# EAGLE design LIC_rack_HUSB-00 (EAGLE 7.2.0)
AUTHOR: M. Petrilak; VERSION: 00

## Sheet 1 of 4
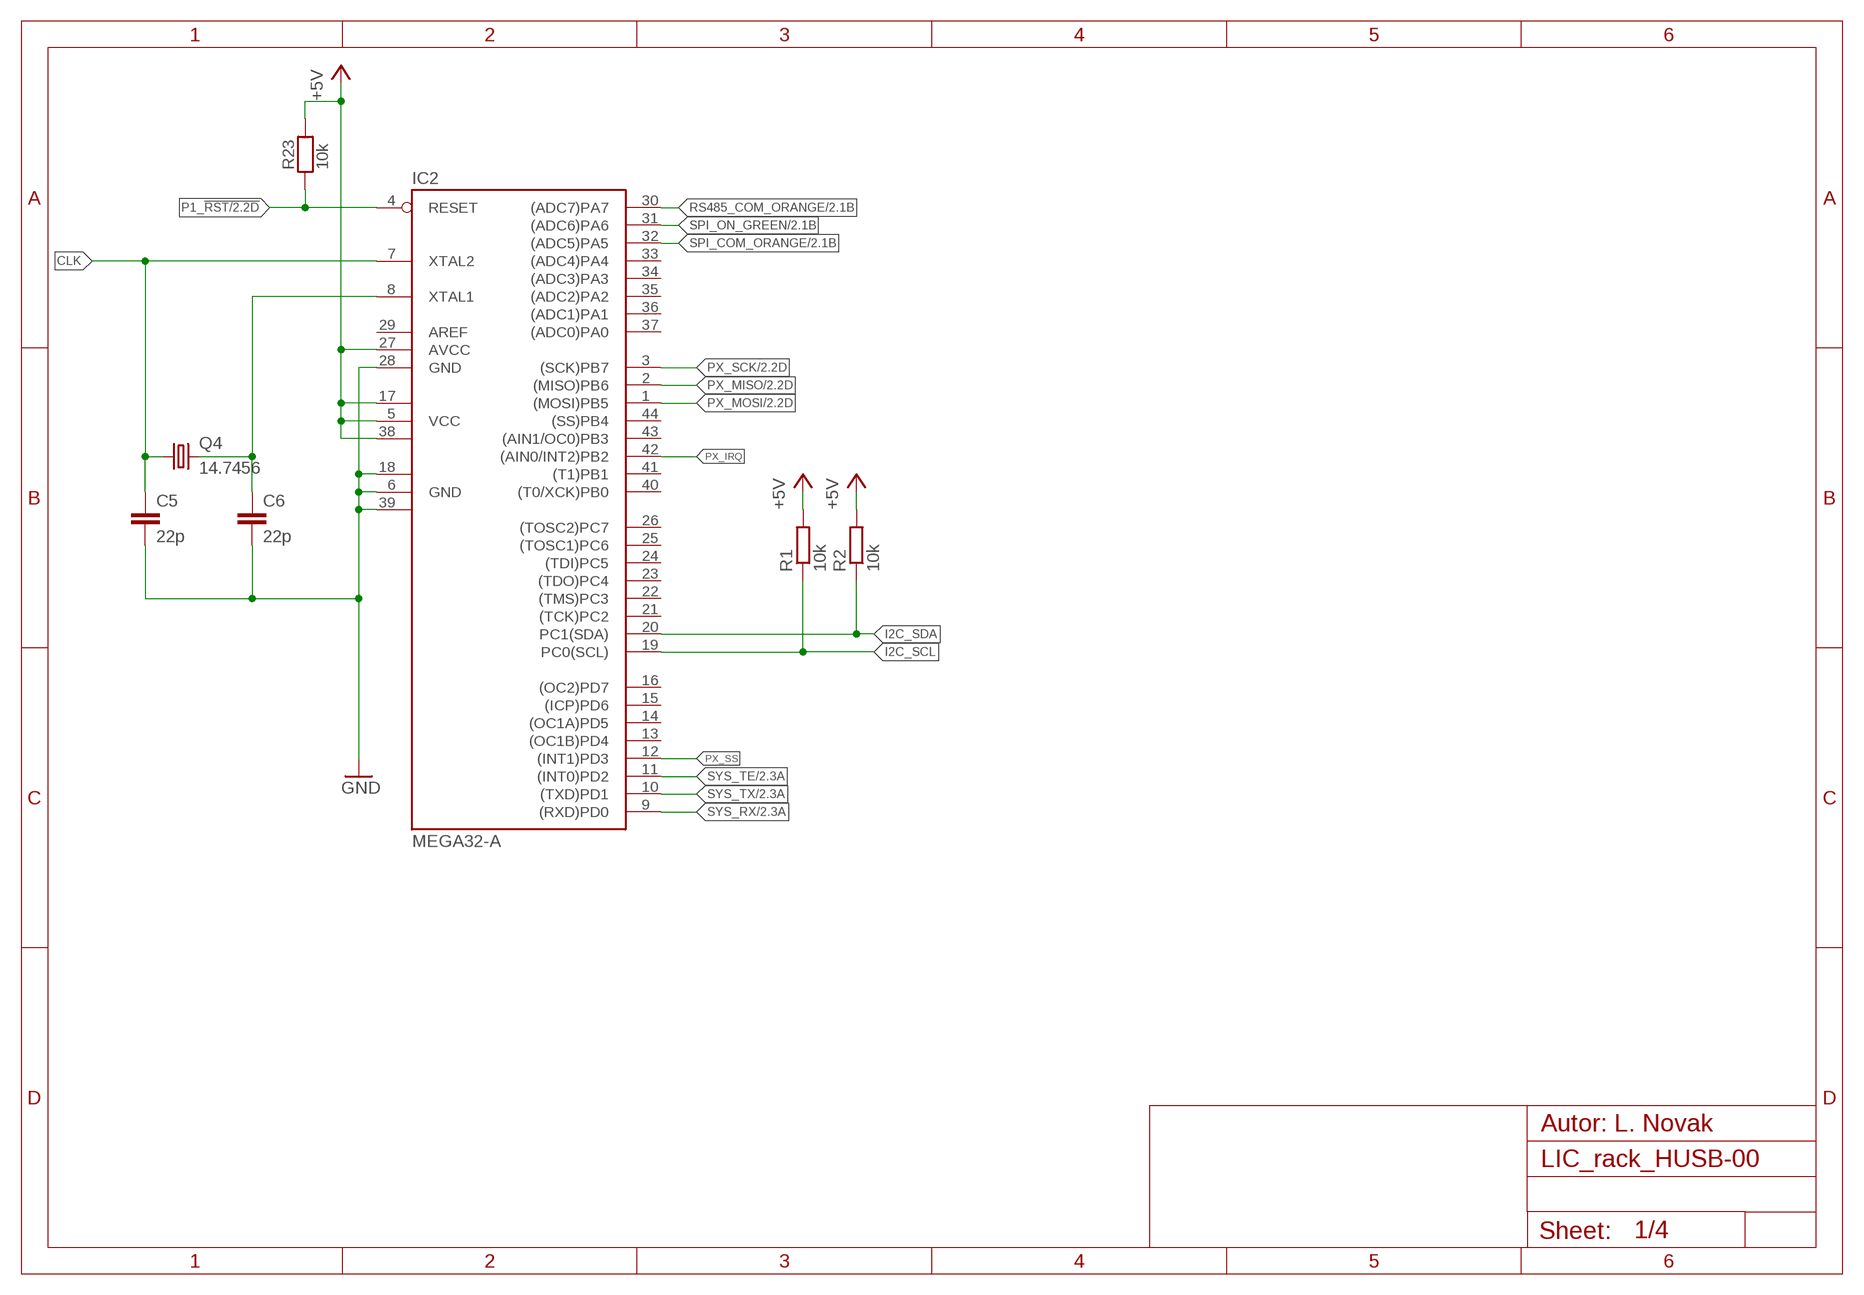
[diagram p0: schematic, sheet 1]

### Parts
C5  22p  C-EUC0805  [C0805]
C6  22p  C-EUC0805  [C0805]
IC2  MEGA32-A  [TQFP44]
Q4  14.7456  XTAL  [HC49U70]
R1  10k  R-EU_R1206  [R1206]
R2  10k  R-EU_R1206  [R1206]
R23  10k  R_1206  [1206]

### Nets
+5V: IC2.5(VCC) IC2.17(VCC1) IC2.27(AVCC) IC2.38(VCC2) R1.2 R2.2 R23.2 ; also sheet 2
CLK: C5.1 IC2.7(XTAL2) Q4.1
GND: C5.2 C6.2 IC2.6(GND) IC2.18(GND1) IC2.28(GND) IC2.39(GND2) ; also sheet 2
I2C_SCL: IC2.19(PC0(SCL)) R1.1
I2C_SDA: IC2.20(PC1(SDA)) R2.1
N$19: C6.1 IC2.8(XTAL1) Q4.2
P1_!RST: IC2.4(RESET) R23.1 ; also sheet 2
PX_IRQ: IC2.42((AIN0/INT2)PB2)
PX_MISO: IC2.2((MISO)PB6) ; also sheet 2
PX_MOSI: IC2.1((MOSI)PB5) ; also sheet 2
PX_SCK: IC2.3((SCK)PB7) ; also sheet 2
PX_SS: IC2.12((INT1)PD3)
RS485_COM_ORANGE: IC2.30((ADC7)PA7) ; also sheet 2
SPI_COM_ORANGE: IC2.32((ADC5)PA5) ; also sheet 2
SPI_ON_GREEN: IC2.31((ADC6)PA6) ; also sheet 2
SYS_RX: IC2.9((RXD)PD0) ; also sheet 2
SYS_TE: IC2.11((INT0)PD2) ; also sheet 2
SYS_TX: IC2.10((TXD)PD1) ; also sheet 2
Unconnected: IC2.13((OC1B)PD4) IC2.14((OC1A)PD5) IC2.15((ICP)PD6) IC2.16((OC2)PD7) IC2.21((TCK)PC2) IC2.22((TMS)PC3) IC2.23((TDO)PC4) IC2.24((TDI)PC5) IC2.25((TOSC1)PC6) IC2.26((TOSC2)PC7) IC2.29(AREF) IC2.33((ADC4)PA4) IC2.34((ADC3)PA3) IC2.35((ADC2)PA2) IC2.36((ADC1)PA1) IC2.37((ADC0)PA0) IC2.40((T0/XCK)PB0) IC2.41((T1)PB1) IC2.43((AIN1/OC0)PB3) IC2.44((SS)PB4)

## Sheet 2 of 4
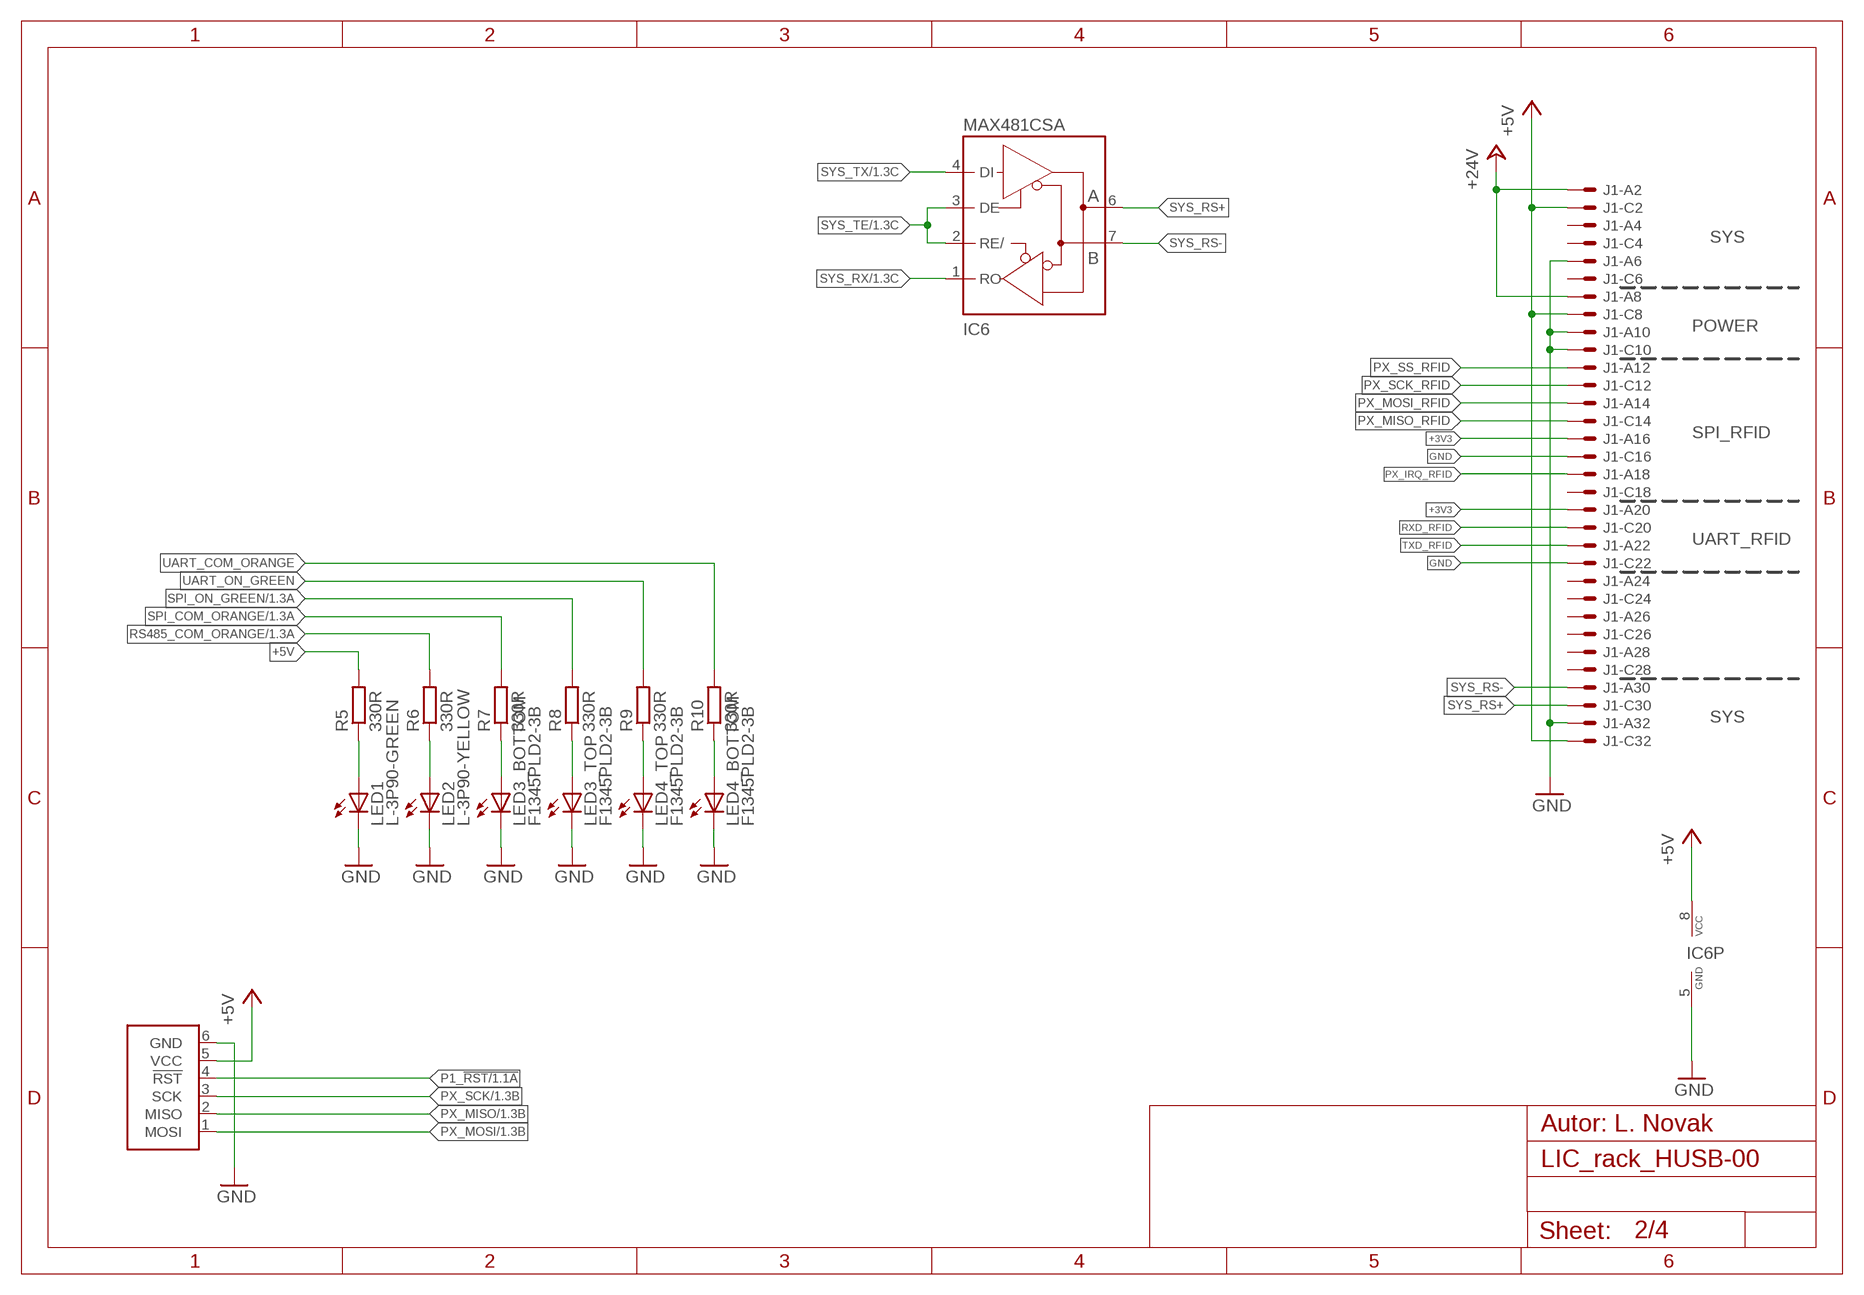
[diagram p1: schematic, sheet 2]

### Parts
IC6  MAX481CSA  [SO08]
J1  VG32SP  [VG32P]
LED1  L-3P90-GREEN  [L-3P90]
LED2  L-3P90-YELLOW  [L-3P90]
LED3  F1345PLD2-3B  [F1345PLD2-3B]
LED4  F1345PLD2-3B  [F1345PLD2-3B]
R5  330R  R-EU_R1206  [R1206]
R6  330R  R-EU_R1206  [R1206]
R7  330R  R-EU_R1206  [R1206]
R8  330R  R-EU_R1206  [R1206]
R9  330R  R-EU_R1206  [R1206]
R10  330R  R-EU_R1206  [R1206]
U1  ATPROG-V  [6410-06]

### Nets
+3V3: J1.A16 J1.A20
+5V: IC6.8(VCC) J1.C2 J1.C8 J1.C32 R5.2 U1.5(VCC) ; also sheet 1
+24V: J1.A2 J1.A8
GND: IC6.5(GND) J1.A6 J1.A10 J1.A32 J1.C10 J1.C16 J1.C22 LED1.K(C) LED2.K(C) LED3.1K(C) LED3.2K(C) LED4.1K(C) LED4.2K(C) U1.6(GND) ; also sheet 1
N$1: LED2.A R6.1
N$2: LED1.A R5.1
N$9: LED4.1A(A) R10.1
N$10: LED4.2A(A) R9.1
N$11: LED3.2A(A) R8.1
N$12: LED3.1A(A) R7.1
P1_!RST: U1.4(!RST) ; also sheet 1
PX_IRQ_RFID: J1.A18
PX_MISO: U1.2(MISO) ; also sheet 1
PX_MISO_RFID: J1.C14
PX_MOSI: U1.1(MOSI) ; also sheet 1
PX_MOSI_RFID: J1.A14
PX_SCK: U1.3(SCK) ; also sheet 1
PX_SCK_RFID: J1.C12
PX_SS_RFID: J1.A12
RS485_COM_ORANGE: R6.2 ; also sheet 1
RXD_RFID: J1.C20
SPI_COM_ORANGE: R7.2 ; also sheet 1
SPI_ON_GREEN: R8.2 ; also sheet 1
SYS_RS+: IC6.6(A) J1.C30
SYS_RS-: IC6.7(B) J1.A30
SYS_RX: IC6.1(RO) ; also sheet 1
SYS_TE: IC6.2(RE/) IC6.3(DE) ; also sheet 1
SYS_TX: IC6.4(DI) ; also sheet 1
TXD_RFID: J1.A22
UART_COM_ORANGE: R10.2
UART_ON_GREEN: R9.2
Unconnected: J1.A4 J1.A24 J1.A26 J1.A28 J1.C4 J1.C6 J1.C18 J1.C24 J1.C26 J1.C28

### Notes on the sheet
- SYS
- POWER
- SPI_RFID
- UART_RFID
- SYS

## Sheet 3 of 4
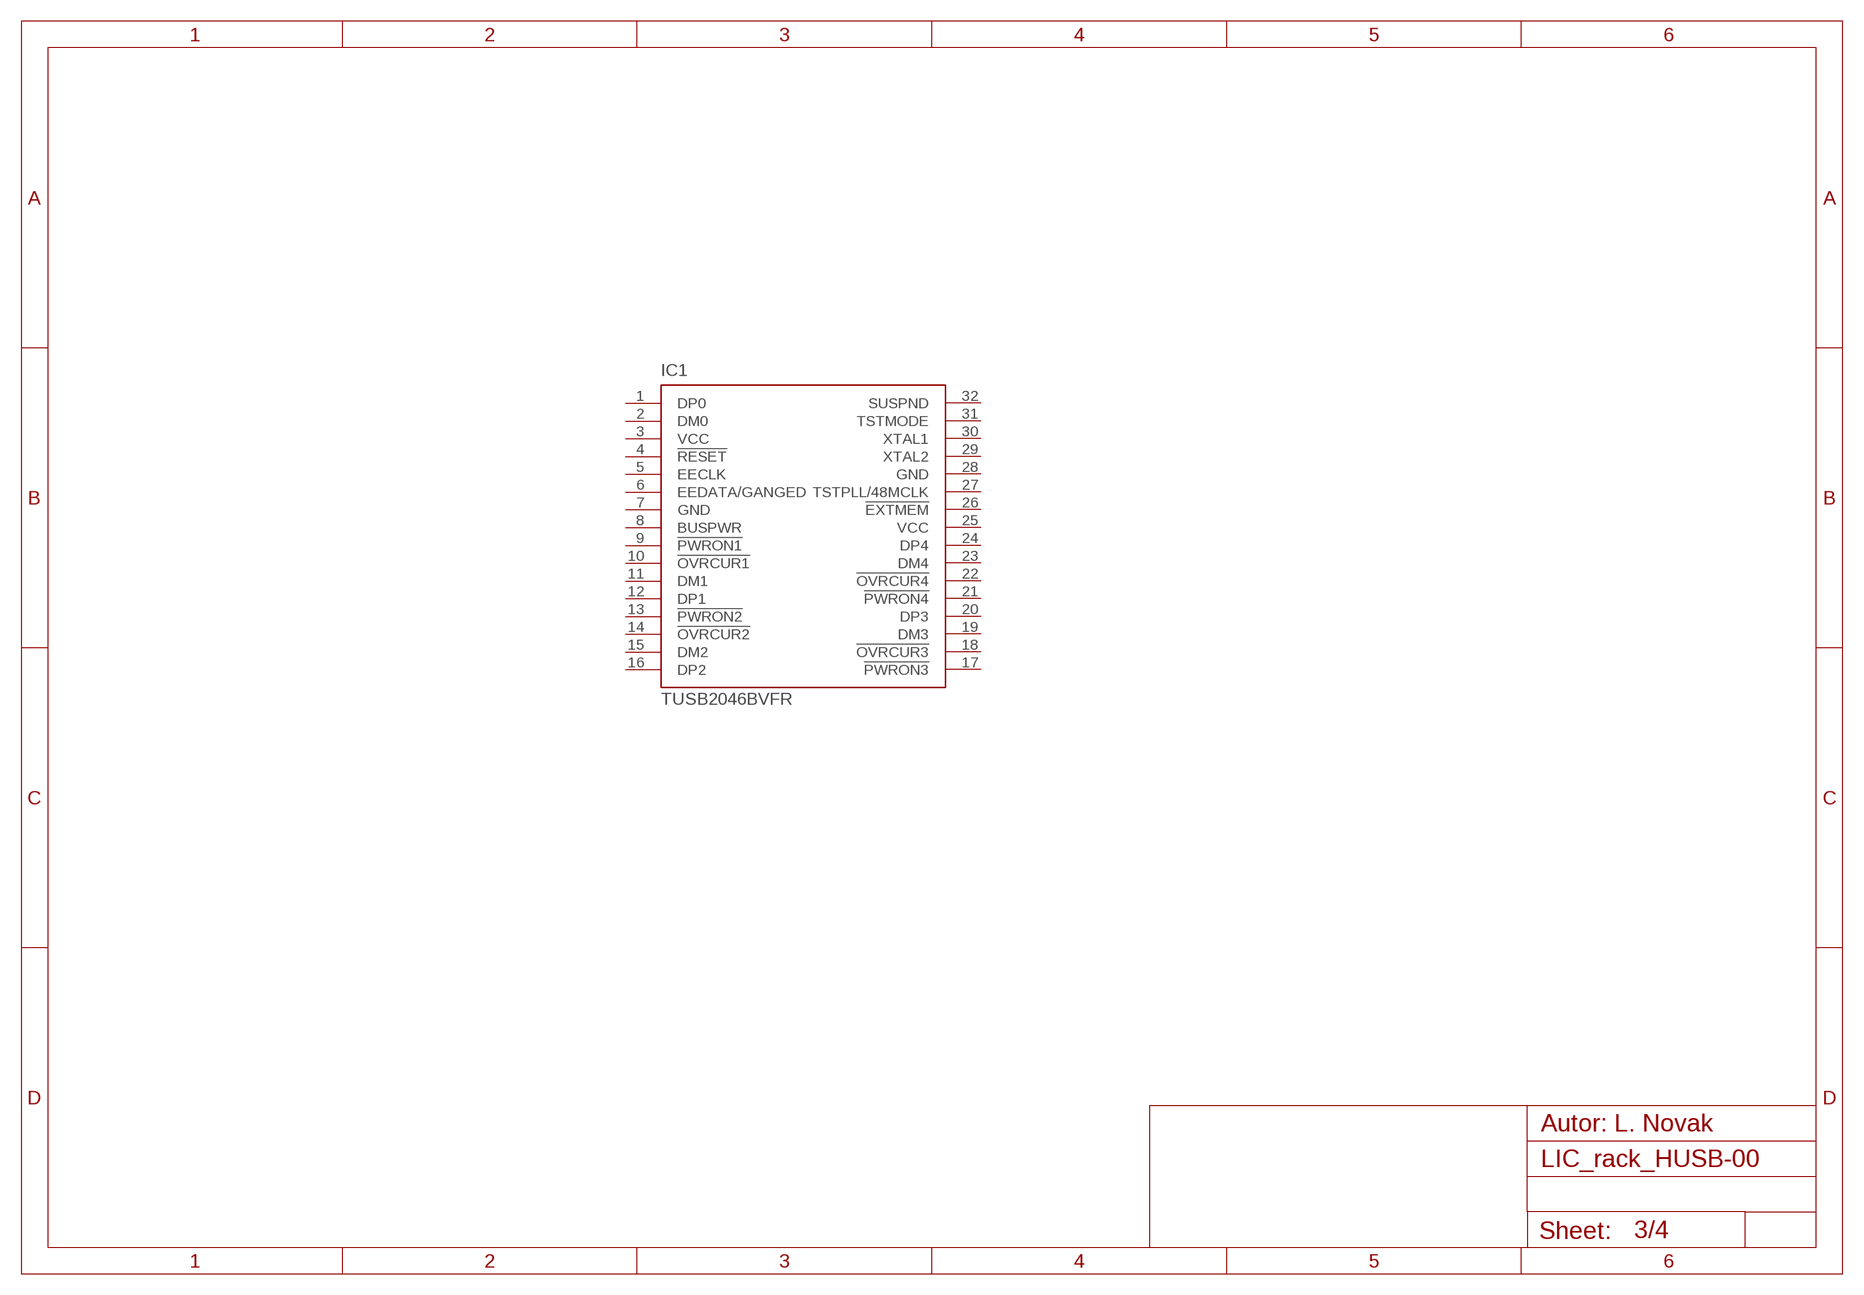
[diagram p2: schematic, sheet 3]

### Parts
IC1  TUSB2046BVFR  [VF_S-PQFP-G32]
Unconnected: IC1.1(DP0) IC1.2(DM0) IC1.4(!RESET) IC1.5(EECLK) IC1.6(EEDATA/GANGED) IC1.8(BUSPWR) IC1.9(!PWRON1) IC1.10(!OVRCUR1) IC1.11(DM1) IC1.12(DP1) IC1.13(!PWRON2) IC1.14(!OVRCUR2) IC1.15(DM2) IC1.16(DP2) IC1.17(!PWRON3) IC1.18(!OVRCUR3) IC1.19(DM3) IC1.20(DP3) IC1.21(!PWRON4) IC1.22(!OVRCUR4) IC1.23(DM4) IC1.24(DP4) IC1.26(!EXTMEM) IC1.27(TSTPLL/48MCLK) IC1.29(XTAL2) IC1.30(XTAL1) IC1.31(TSTMODE) IC1.32(SUSPND)

## Sheet 4 of 4
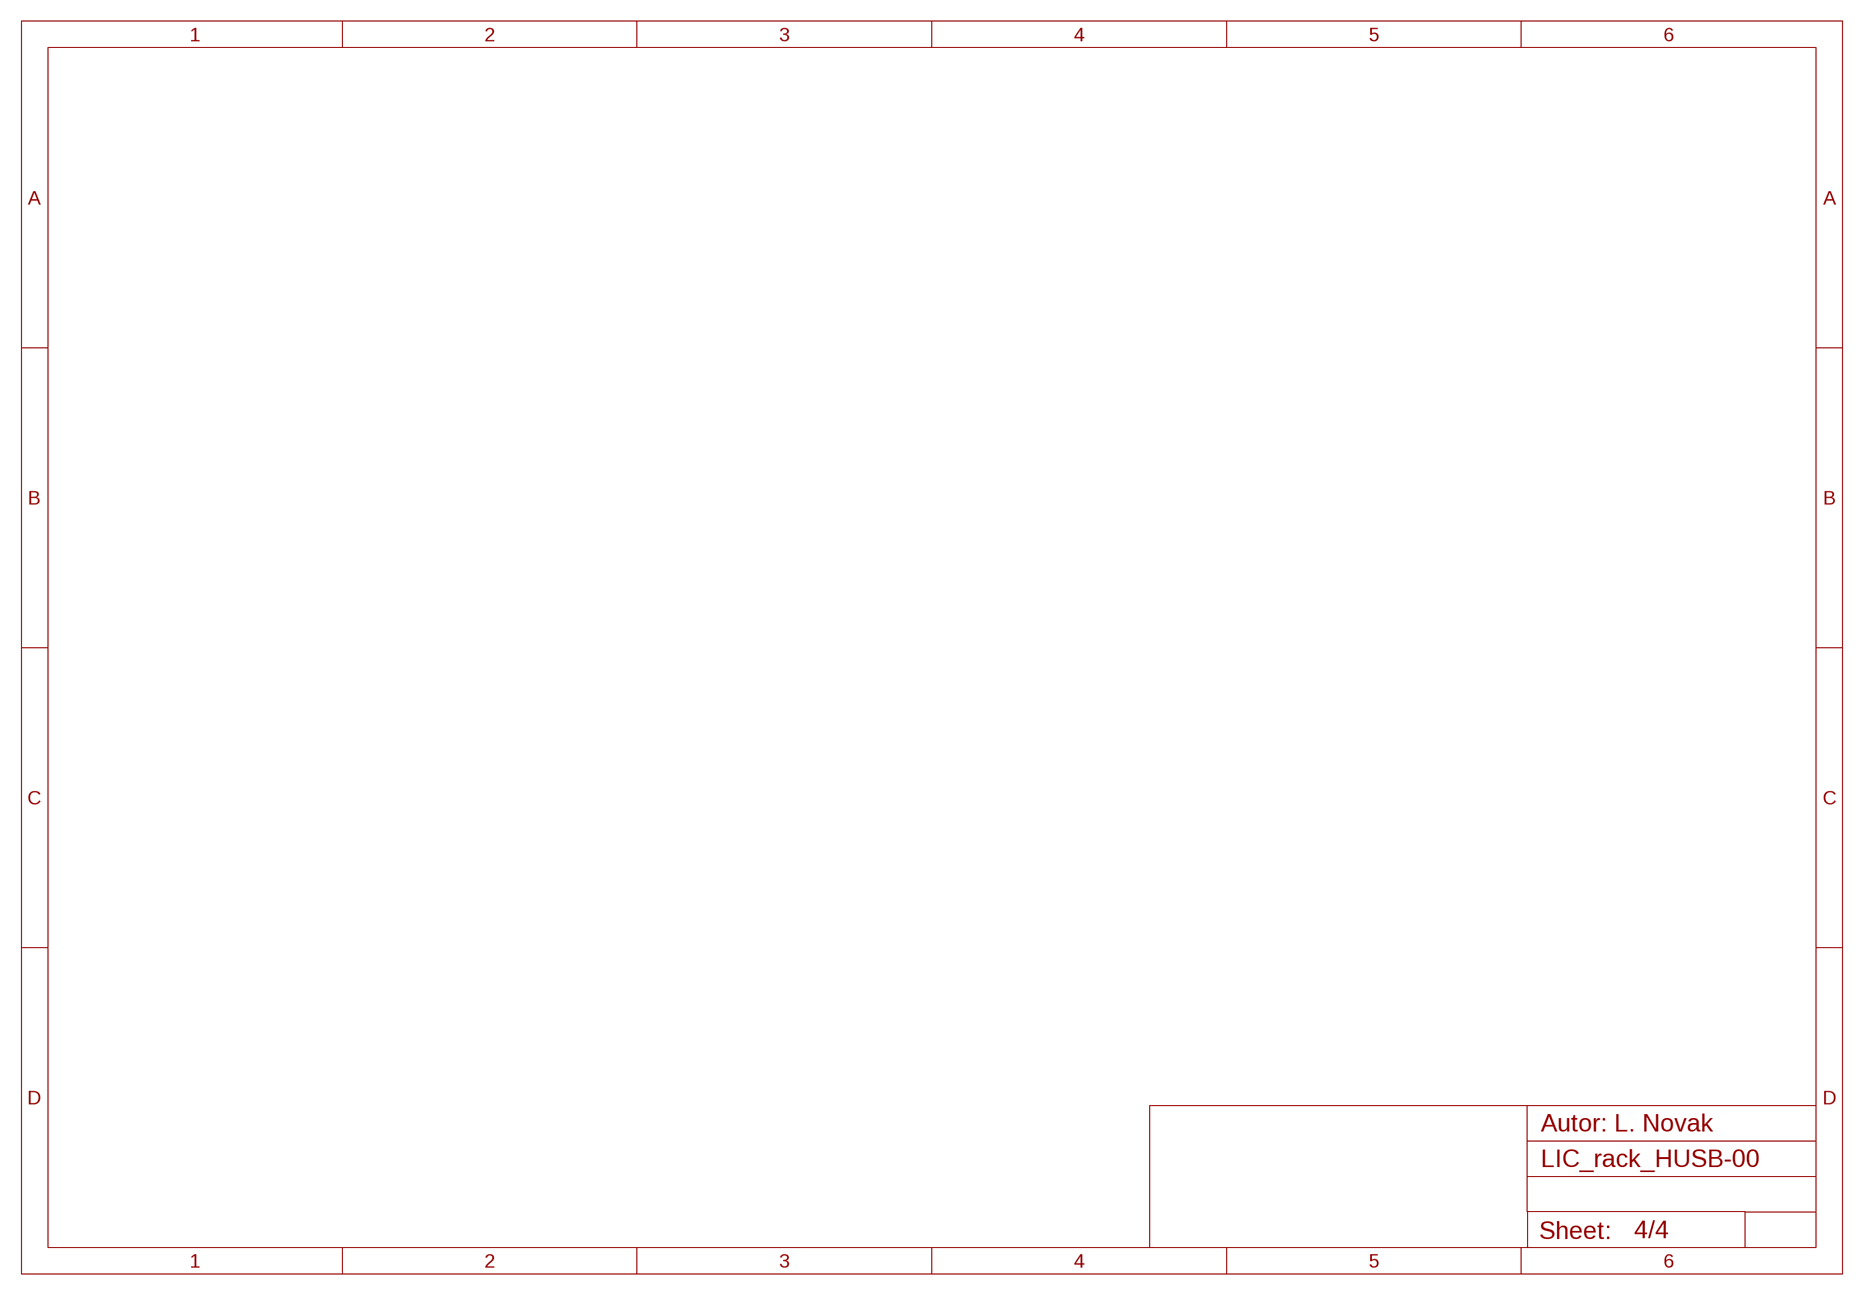
[diagram p3: schematic, sheet 4]

## Power pins joined to a net without a drawn wire
GND: IC1.7(GND) IC1.28(GND)
VCC: IC1.3(VCC) IC1.25(VCC)

## Library data of the parts
C5 C6 = rcl:C-EU: CAPACITOR, European symbol
IC1 = texas:TUSB2046B: 4-PORT HUB FOR THE UNIVERSAL SERIAL BUS WITH OPTIONAL SERIAL EEPROM INTERFACE Auto generated by make-symbol-device-package-bsdl.ulp Rev. 30 Source: http://focus.ti.com/lit/ds/symlink/tusb2046b.pdf; MF: TEXAS INSTRUMENTS; MPN: TUSB2046BVFR; OC_FARNELL: 1470507; OC_NEWARK: 77C1806
IC2 = atmel:MEGA32: MICROCONTROLLER 32 Kbytes FLASH 2 Kbytes SRAM 1 Kbytes EEPROM USART 8-channel 10 bit ADC Source: www.atmel.com .. doc2503.pdf; MPN: ATMEGA32-16AU; OC_FARNELL: 9171274; OC_NEWARK: 69K6677
IC6 = maxim:MAX481CSA: RS485 TRANSEIVER
J1 = 19inch:VG32S: PCB EUROCARD, 32-pin type C/AC, 5.08 mm
LED1 LED2 = led:L-3P90
LED3 LED4 = led:F1345PLD2-3B
Q4 = crystal:XTAL
R1 R2 R5-R10 = rcl:R-EU_: RESISTOR, European symbol
R23 = #PaJa_31:R: Rezistor
U1 = con-molex:ATPROG

## Board
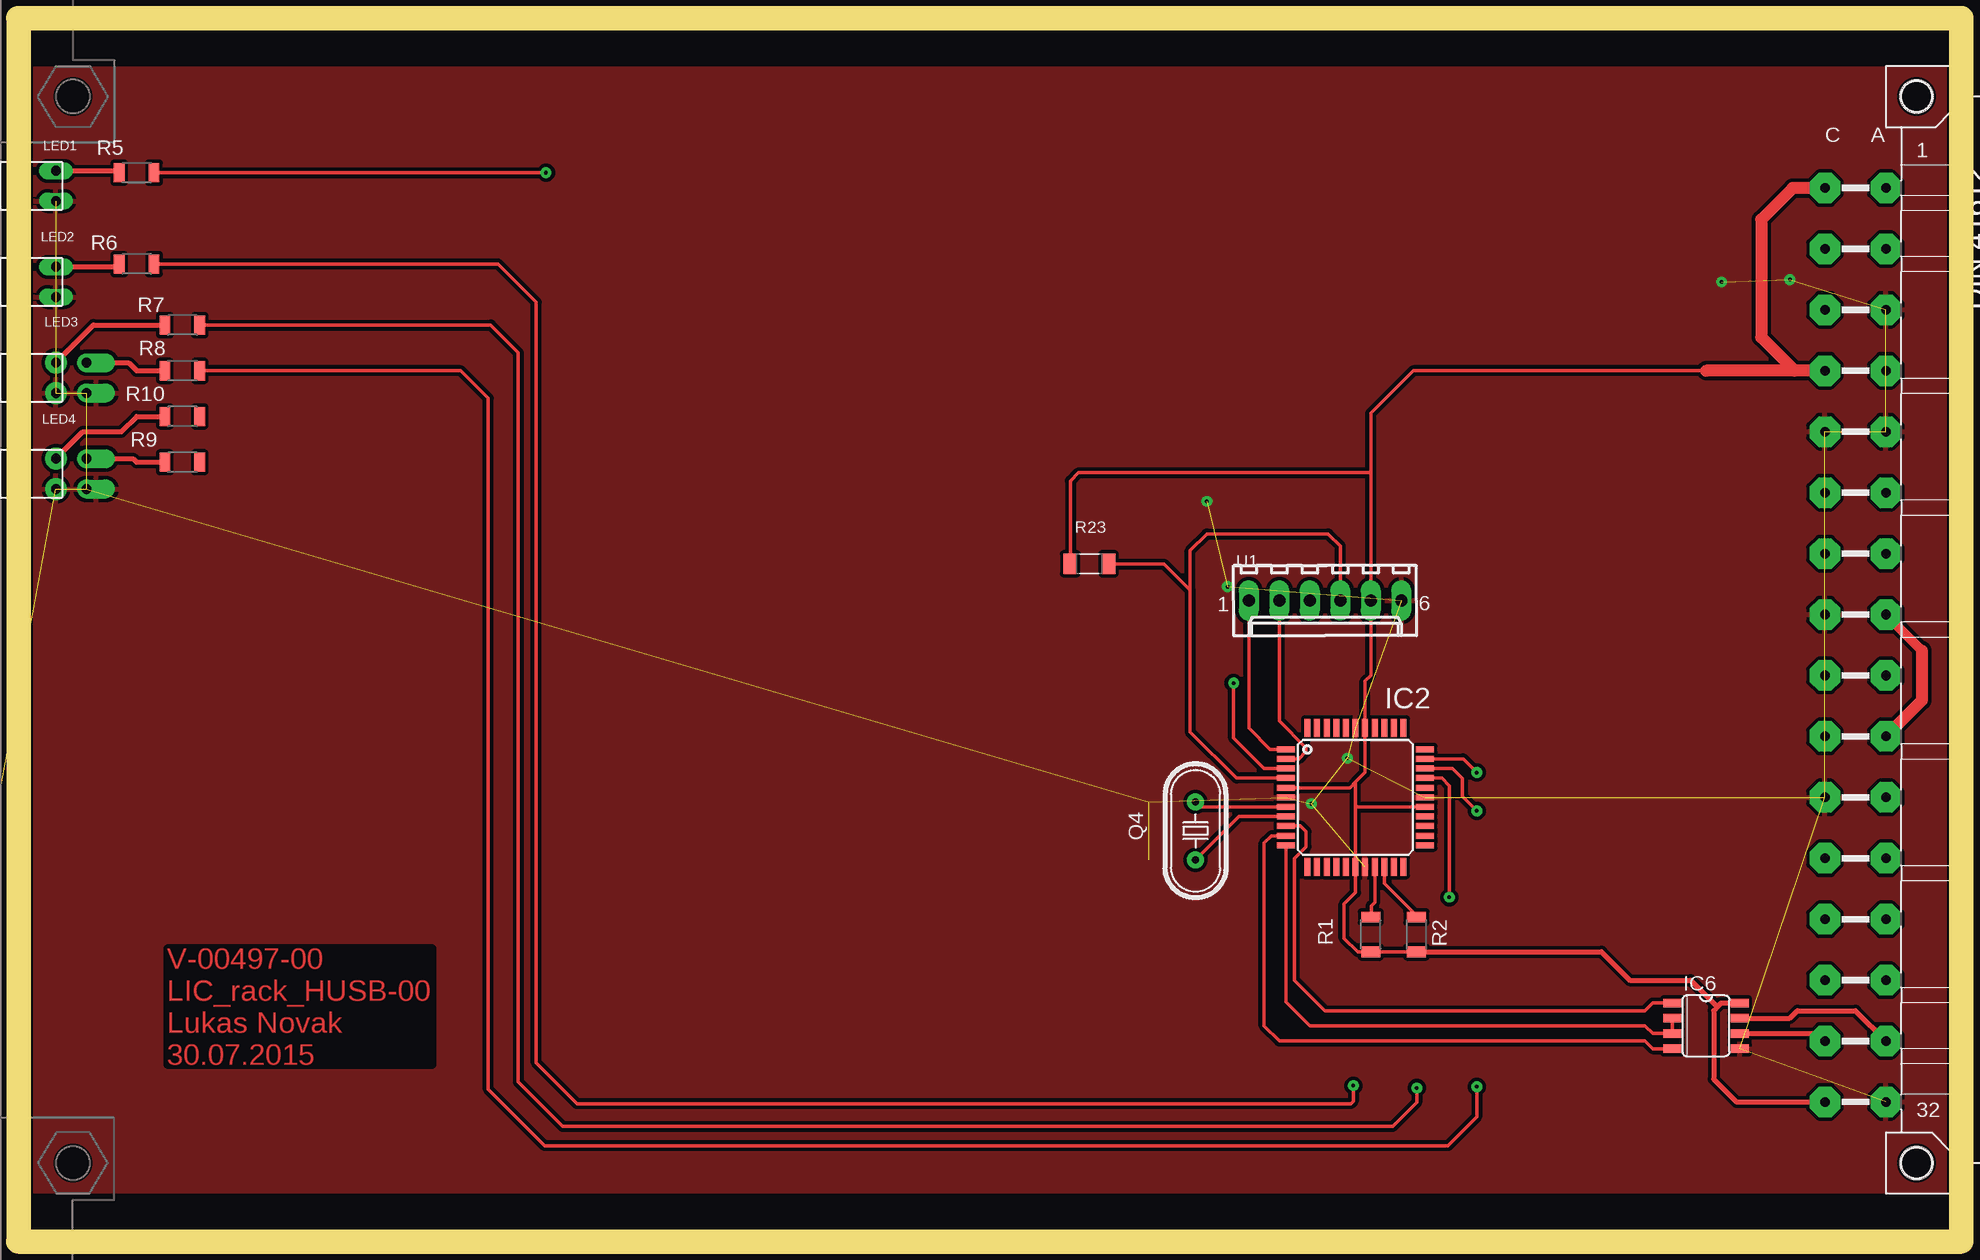
[diagram p4: board, top side]
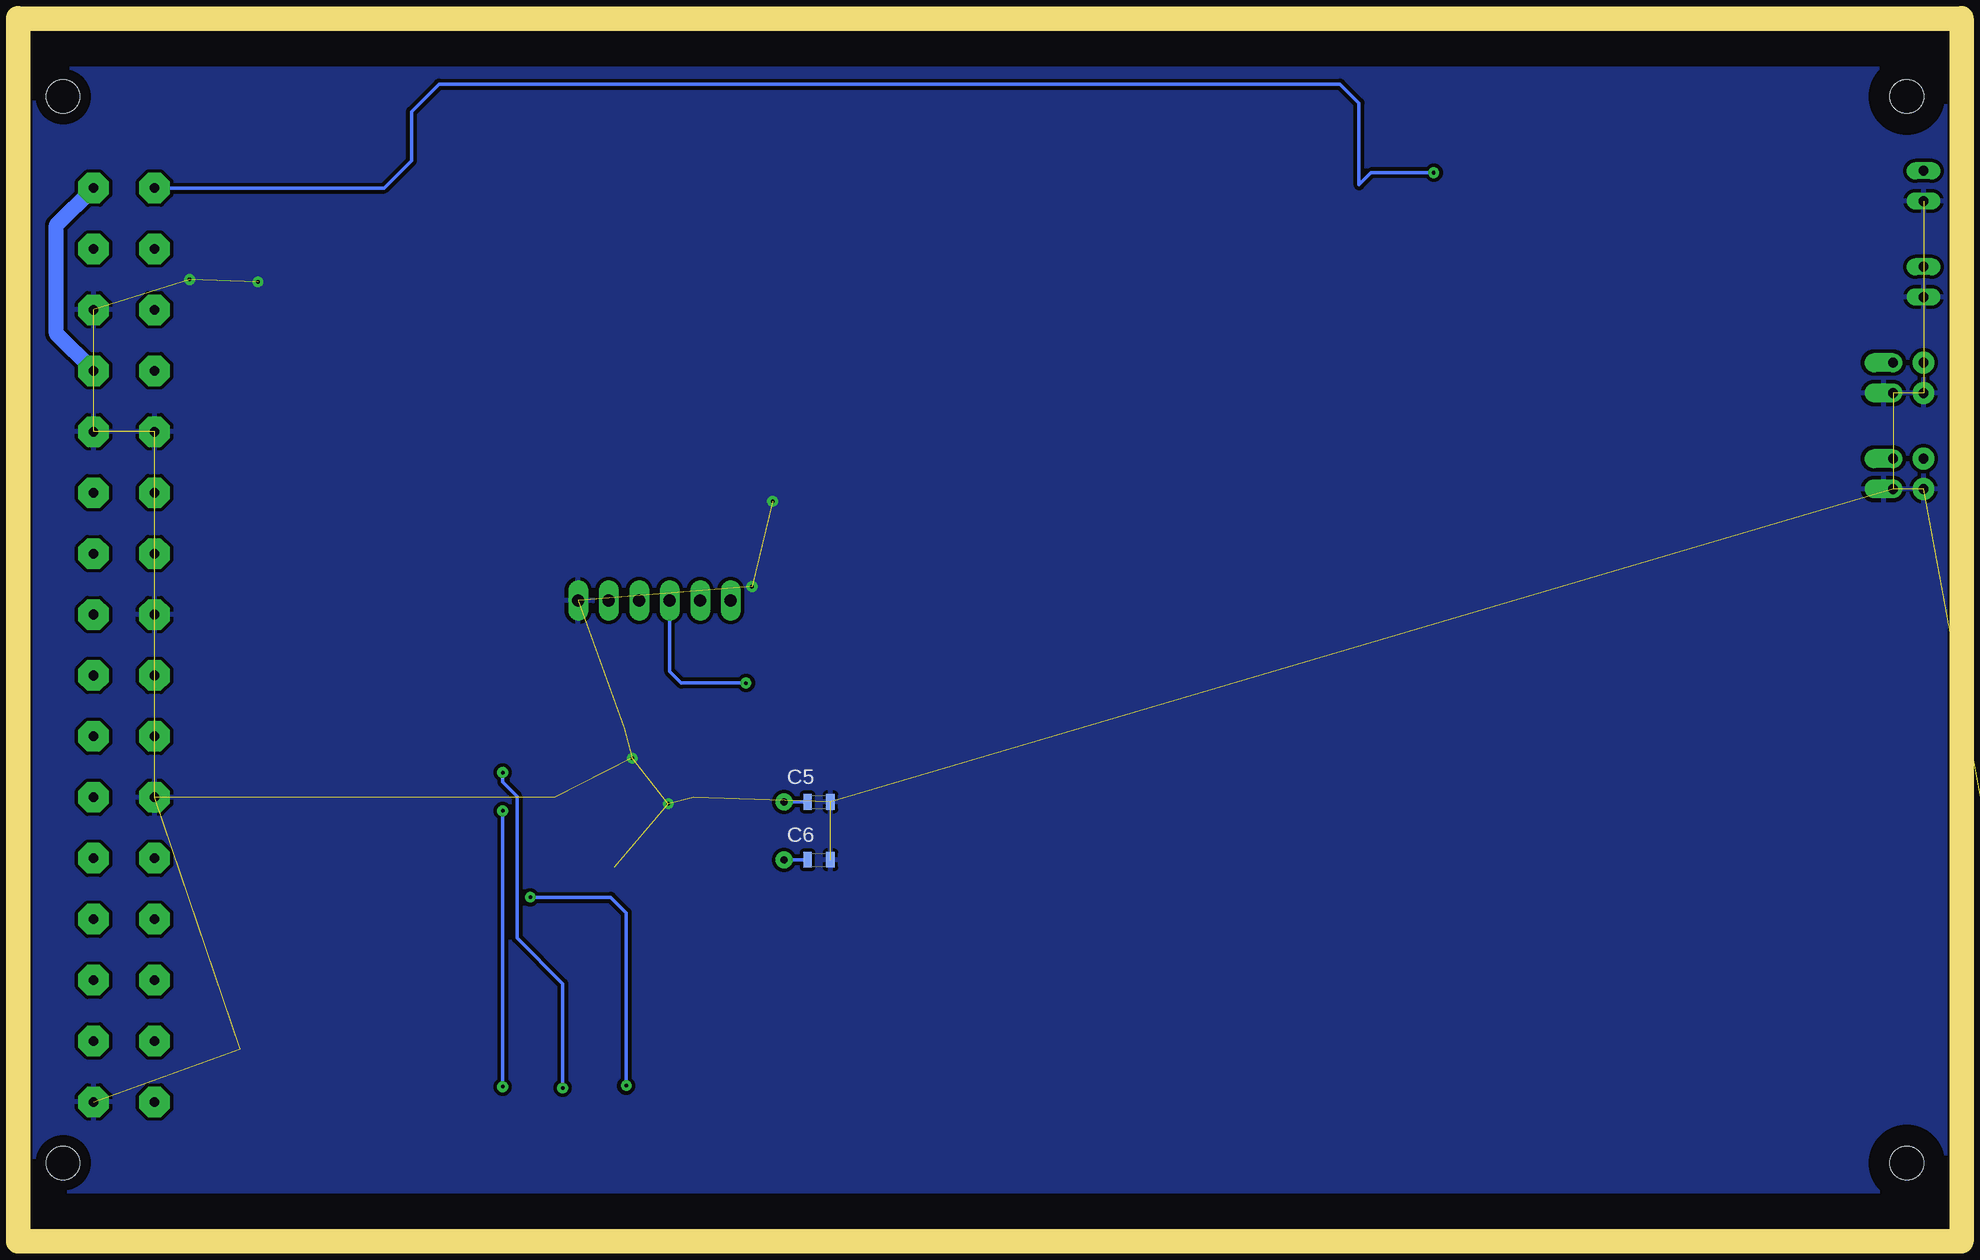
[diagram p5: board, bottom side, seen from below]

Size 160 x 100 mm. Coordinates in mm from the lower left corner, seen from the top.
Copper layers (1*16): Top 0.04mm / dielectric 1.5mm / Bottom 0.04mm
Design rules "mucha_navrh_my_fine *": minimum track width 0.2mm, minimum drill 0.3mm, track to track 0.3mm, track to pad 0.3mm, pad to pad 0.3mm, via to via 0.3mm, smd to smd 0mil, copper to edge 0.2mm, drill to drill 0.2mm, minimum pad ring 0.3mm, minimum via ring 0.3mm, stop-mask expansion 0.1mm, vias tented up to drill 0.5mm, thermal gap 0.3mm

### Footprints (pad centres in the part's own frame; a part is rotated, then mirrored left to right if it is on the bottom)
C0805 = smd 0.7 x 1.3: 1 -0.95,0; 2 0.95,0
VF_S-PQFP-G32 = smd 1.05 x 0.5: 1 -4.375,2.8; 2 -4.375,2; 3 -4.375,1.2; 4 -4.375,0.4; 5 -4.375,-0.4; 6 -4.375,-1.2; 7 -4.375,-2; 8 -4.375,-2.8; 17 4.375,-2.8; 18 4.375,-2; 19 4.375,-1.2; 20 4.375,-0.4; 21 4.375,0.4; 22 4.375,1.2; 23 4.375,2; 24 4.375,2.8 | smd 0.5 x 1.05: 9 -2.8,-4.375; 10 -2,-4.375; 11 -1.2,-4.375; 12 -0.4,-4.375; 13 0.4,-4.375; 14 1.2,-4.375; 15 2,-4.375; 16 2.8,-4.375; 25 2.8,4.375; 26 2,4.375; 27 1.2,4.375; 28 0.4,4.375; 29 -0.4,4.375; 30 -1.2,4.375; 31 -2,4.375; 32 -2.8,4.375
TQFP44 = smd 1.5 x 0.5: 1 -5.8,4; 2 -5.8,3.2; 3 -5.8,2.4; 4 -5.8,1.6; 5 -5.8,0.8; 6 -5.8,0; 7 -5.8,-0.8; 8 -5.8,-1.6; 9 -5.8,-2.4; 10 -5.8,-3.2; 11 -5.8,-4; 23 5.8,-4; 24 5.8,-3.2; 25 5.8,-2.4; 26 5.8,-1.6; 27 5.8,-0.8; 28 5.8,0; 29 5.8,0.8; 30 5.8,1.6; 31 5.8,2.4; 32 5.8,3.2; 33 5.8,4 | smd 0.5 x 1.5: 12 -4,-5.8; 13 -3.2,-5.8; 14 -2.4,-5.8; 15 -1.6,-5.8; 16 -0.8,-5.8; 17 0,-5.8; 18 0.8,-5.8; 19 1.6,-5.8; 20 2.4,-5.8; 21 3.2,-5.8; 22 4,-5.8; 34 4,5.8; 35 3.2,5.8; 36 2.4,5.8; 37 1.6,5.8; 38 0.8,5.8; 39 0,5.8; 40 -0.8,5.8; 41 -1.6,5.8; 42 -2.4,5.8; 43 -3.2,5.8; 44 -4,5.8
SO08 = smd 0.72 x 1.5: 1 -1.905,-2.8; 2 -0.635,-2.8; 3 0.635,-2.8; 4 1.905,-2.8; 5 1.905,2.8; 6 0.635,2.8; 7 -0.635,2.8; 8 -1.905,2.8
VG32P = drill 0.8 pad 2.54 octagon: A2 154.7,36.83; A4 154.7,31.75; A6 154.7,26.67; A8 154.7,21.59; A10 154.7,16.51; A12 154.7,11.43; A14 154.7,6.35; A16 154.7,1.27; A18 154.7,-3.81; A20 154.7,-8.89; A22 154.7,-13.97; A24 154.7,-19.05; A26 154.7,-24.13; A28 154.7,-29.21; A30 154.7,-34.29; A32 154.7,-39.37; C2 149.62,36.83; C4 149.62,31.75; C6 149.62,26.67; C8 149.62,21.59; C10 149.62,16.51; C12 149.62,11.43; C14 149.62,6.35; C16 149.62,1.27; C18 149.62,-3.81; C20 149.62,-8.89; C22 149.62,-13.97; C24 149.62,-19.05; C26 149.62,-24.13; C28 149.62,-29.21; C30 149.62,-34.29; C32 149.62,-39.37 | hole 2.794: 3.57,44.45; 3.57,-44.45; 157.24,44.45; 157.24,-44.45; 3.57,44.45; 3.57,-44.45; 157.24,44.45; 157.24,-44.45
L-3P90 = drill 0.813 long: A 4.7,1.27; K 4.7,-1.27
F1345PLD2-3B = drill 0.8 pad 1.8: 1A 4.7,1.27; 1K 4.7,-1.27 | drill 0.8 pad 1.6 offset: 2A 7.24,1.27; 2K 7.24,-1.27
HC49U70 = drill 0.6 pad 1.4: 1 -2.413,0; 2 2.413,0
R1206 = smd 0.9 x 1.6: 1 -1.45,0; 2 1.45,0
1206 = smd 1.143 x 1.702: 1 -1.587,0; 2 1.587,0
6410-06 = drill 1.016 long: 1 6.35,0; 2 3.81,0; 3 1.27,0; 4 -1.27,0; 5 -3.81,0; 6 -6.35,0

### Placement (x,y rotation side)
C5  94.23,35.65 0 bottom
C6  94.23,30.82 0 bottom
IC1  -10.2,-7.4 0 top  (outside the outline)
IC2  110.49,36.03 0 top
IC6  139.7,16.98 270 top
J1  0,50 0 top
LED1  -2.54,87 0 top
LED2  -2.54,79 0 top
LED3  -2.54,71 0 top
LED4  -2.54,63 0 top
Q4  97.16,33.24 270 top
R1  111.76,24.6 270 top
R2  115.57,24.6 270 top
R5  8.89,88.1 0 top
R6  8.89,80.48 0 top
R7  12.7,75.4 0 top
R8  12.7,71.59 0 top
R9  12.7,63.97 0 top
R10  12.7,67.78 0 top
R23  88.3,55.5 180 top
U1  107.95,52.43 180 top

### Tracks (layer width: path | path; a pad name or v marks a point on that pad's centre or on a via)
+3V3
  Top 0.813: 157.7,48.27 J1.A16
  Top 1.016: J1.A20 157.7,44.11 157.7,48.27
+5V  (via drill 0.3)
  Top 0.305: IC2.5 110.02,36.83 110.49,37.3 | 110.49,37.3 111.29,38.1 IC2.38 111.29,45.72 111.76,46.19 U1.5 111.76,63.2 | IC2.27 110.66,35.23 110.49,35.39 | 110.49,35.39 110.49,37.3 | 110.49,35.39 IC2.17 110.49,28.09 109.54,27.14 109.54,24.28 110.67,23.15 R1.2 R2.2 | 111.76,63.2 111.76,68.06 115.3,71.6 139.72,71.6 | R5.2 v43,88.1 | 111.76,63.2 111.66,63.1 87.4,63.1 86.71,62.41 R23.2
  Top 0.406: J1.C32 142.24,10.63 140.34,12.53 140.34,18.25 140.65,18.57 | 140.65,18.57 140.97,18.89 IC6.8 | R2.2 130.99,23.15 133.35,20.79 138.43,20.79 140.65,18.57
  Top 1.016: J1.C8 147.1,71.59 | 147.1,71.59 139.73,71.59 139.72,71.6 | J1.C2 146.93,86.83 144.3,84.2 144.3,74.39 147.1,71.59
  Bottom 0.305: J1.C2 130.47,86.83 128.2,89.1 128.2,93.2 125.9,95.5 50.8,95.5 49.21,93.91 49.21,87.1 48.21,88.1 v43,88.1
+24V
  Bottom 1.27: J1.A2 157.8,83.73 157.8,74.69 J1.A8
CLK
  Top 0.305: IC2.7 97.57,35.23 Q4.1
  Bottom 0.305: 97.16,35.78 Q4.1 C5.1
GND  (via drill 0.3)  (27 unrouted)
  other vias: 99.82,53.6 146.7,79.2 141,79 106.8,35.5 109.8,39.3 98.1,60.7
  pour Bottom: 0,-0.8 160.02,-0.8 160.02,99.53 0,99.53
  pour Top: 0,0.47 160.02,0.47 160.02,99.53 0,99.53
I2C_SCL
  Top 0.305: IC2.19 112.09,27.29 111.8,27 111.8,26.09 R1.1
I2C_SDA
  Top 0.305: IC2.20 112.89,28.87 115.57,26.19 R2.1
N$1
  Top 0.406: LED2.A 7.23,80.27 R6.1
N$2
  Top 0.406: LED1.A 7.27,88.27 R5.1
N$9
  Top 0.406: R10.1 8.89,67.78 7.62,66.51 6.35,66.51 4.4,66.51 LED4.1A
N$10
  Top 0.406: LED4.2A 8.59,64.27 8.89,63.97 R9.1
N$11
  Top 0.406: LED3.2A 8.21,72.27 8.89,71.59 R8.1
N$12
  Top 0.406: LED3.1A 5.29,75.4 R7.1
N$19
  Top 0.305: IC2.8 100.76,34.43 Q4.2
  Bottom 0.305: C6.1 Q4.2
P1_!RST
  Top 0.305: 96.7,53.3 96.7,41.5 100.57,37.63 IC2.4 | 96.7,53.3 94.54,55.46 89.93,55.46 R23.1 | U1.4 109.22,56.98 108.2,58 98.1,58 96.7,56.6 96.7,53.3
PX_IRQ_RFID
  Top 0.305: J1.A18
PX_MISO
  Top 0.305: IC2.2 105.75,39.23 106.36,39.84 106.36,40.16 104.14,42.38 U1.2
PX_MOSI
  Top 0.305: IC2.1 103.37,40.03 101.6,41.8 101.6,42.72 101.59,42.73 101.59,48.72 U1.1
PX_SCK  (via drill 0.3)
  Top 0.305: IC2.3 102.86,38.43 100.33,40.96 v100.33,45.55
  Bottom 0.305: U1.3 106.68,46.51 105.73,45.55 v100.33,45.55
RS485_COM_ORANGE  (via drill 0.3)
  Top 0.305: IC2.30 117.67,37.63 118.3,37 v118.3,27.7 | R6.2 10.36,80.5 39,80.5 42.2,77.3 42.2,13.9 45.6,10.5 110.1,10.5 110.3,10.7 v110.3,12
  Bottom 0.305: v118.3,27.7 111.6,27.7 110.3,26.4 v110.3,12
SPI_COM_ORANGE  (via drill 0.3)
  Top 0.305: IC2.32 119.47,39.23 v120.6,38.1 | R7.2 38.4,75.4 40.7,73.1 40.7,12.3 44.4,8.6 113.6,8.6 115.6,10.6 v115.6,11.8
  Bottom 0.305: v120.6,38.1 120.6,37.3 119.4,36.1 119.4,24.3 115.6,20.5 v115.6,11.8
SPI_ON_GREEN  (via drill 0.3)
  Top 0.305: IC2.31 118.57,38.43 119.4,37.6 119.4,36.1 v120.6,34.9 | v120.6,11.9 120.6,9.4 118.2,7 42.9,7 38.2,11.7 38.2,69.3 35.9,71.6 R8.2
  Bottom 0.305: v120.6,34.9 v120.6,11.9
SYS_RS+
  Top 0.406: IC6.6 148.99,16.34 J1.C30
SYS_RS-
  Top 0.406: IC6.7 146.69,17.62 147.32,18.25 152.16,18.25 J1.A30
SYS_RX
  Top 0.305: IC6.1 135.25,18.89 134.62,18.25 107.95,18.25 105.41,20.79 105.41,30.95 106.36,31.9 106.36,33.17 105.91,33.63 IC2.9
SYS_TE
  Top 0.305: IC6.2 IC6.3 135.25,16.34 134.62,16.98 106.68,16.98 104.69,18.97 IC2.11
SYS_TX
  Top 0.305: IC6.4 135.25,15.08 134.62,15.71 104.14,15.71 102.87,16.98 102.87,32.22 103.48,32.83 IC2.10
VCC  (1 unrouted)

### Text on the board
Top: V-00497-00 / LIC_rack_HUSB-00 / Lukas Novak / 30.07.2015